# Altium schematic sheet Sheet1.SchDoc: Optical Audio Transmitter
size A4; ApprovedBy: Matej Gomboc; CheckedBy: Matej Gomboc; Author: Matej Gomboc; DrawnBy: Matej Gomboc; Engineer: Matej Gomboc; DocumentNumber: 1; Revision: 1.0; SheetNumber: 1; SheetTotal: 1; DocumentName: Optical Audio Transmitter; ProjectName: Optical Audio Transmitter; Application_BuildNumber: 1
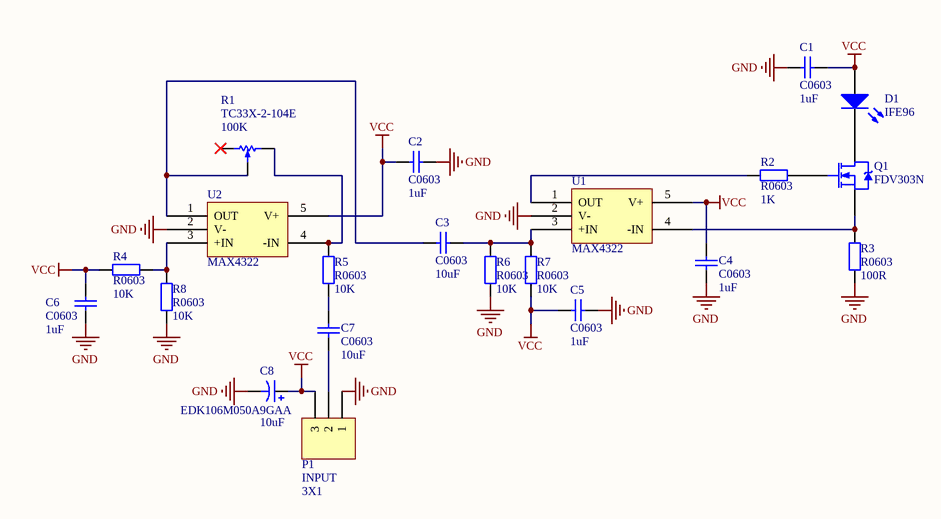
[diagram p0: Sheet1.SchDoc]

## Parts
C1  C0603  value 1uF  [1608[0603]]
C2  C0603  value 1uF  [1608[0603]]
C3  C0603  value 10uF  [1608[0603]]
C4  C0603  value 1uF  [1608[0603]]
C5  C0603  value 1uF  [1608[0603]]
C6  C0603  value 1uF  [1608[0603]]
C7  C0603  value 10uF  [1608[0603]]
C8  EDK106M050A9GAA  value 10uF  [EDK106M050A9GAA]
D1  IFE96  [IFE96]
P1  INPUT  value 3X1  [HDR1X3]
Q1  FDV303N  [SOT23_M]
R1  TC33X-2-104E  value 100K  [TC33X-2-104E]
R2  R0603  value 1K  [J1-0603]
R3  R0603  value 100R  [J1-0603]
R4  R0603  value 10K  [J1-0603]
R5  R0603  value 10K  [J1-0603]
R6  R0603  value 10K  [J1-0603]
R7  R0603  value 10K  [J1-0603]
R8  R0603  value 10K  [J1-0603]
U1  MAX4322  [MAX4322_SOT23-5]
U2  MAX4322  [MAX4322_SOT23-5]

## Nets
GND: C1.2 C2.2 C4.1 C5.2 C6.1 C8.2 P1.1 R3.2 R6.2 R8.1 U1.2(V-) U2.2(V-)
VCC: C1.1 C2.1 C4.2 C5.1 C6.2 C8.1 D1.2(A) P1.3 R4.1 R7.2 U1.5(V+) U2.5(V+)
NetC3_1: C3.1 R6.1 R7.1 U1.3(+IN)
NetC3_2: C3.2 R1.2(W) U2.1(OUT)
NetC7_1: C7.1 P1.2
NetC7_2: C7.2 R5.2
NetD1_1: D1.1(K) Q1.2(D)
NetQ1_1: Q1.1(G) R2.2
NetQ1_3: Q1.3(S) R3.1 U1.4(-IN)
NetR1_1: R1.1(+) R5.1 U2.4(-IN)
NetR2_1: R2.1 U1.1(OUT)
NetR4_2: R4.2 R8.2 U2.3(+IN)

Not connected (* = marked no-connect by the designer): R1 3(-)*

## Library data of the parts
C1-C7 = Cap: Ceramic Capacitor
C8 = Cap Pol1: Aluminium Electrolytic Capacitor
D1 = IFE96: Red LED For PMMA
P1 = Header 3: Header, 3-Pin
Q1 = FDV303N: N-channel MOS FET Transistor
R1 = TC33X-2-104E: Potentiometer
R2-R8 = Res2: Resistor
U1 U2 = MAX4322: Single Supply Operational Amplifier